# Altium schematic sheet STM32WB09.SchDoc: STM32WB09 VFQFPN32 (SMPS)
size A3; Date: Not used; ApprovedBy: Not used; CheckedBy: Not used; Author: Not used; CompanyName: STMicroelectronics; DrawnBy: Not used; Engineer: Not used; Organization: Not used; Address1: Not used; Address2: Not used; Address3: Not used; Address4: Not used; DocumentNumber: Not used; Revision: 1.0.0; SheetNumber: 2; SheetTotal: 6; CurrentTime: Not used; CurrentDate: Not used; Time: Not used; DocumentFullPathAndName: Not used; DocumentName: Not used; ModifiedDate: Not used; ImagePath: Not used; ProjectName: Not used; Application_BuildNumber: Not used
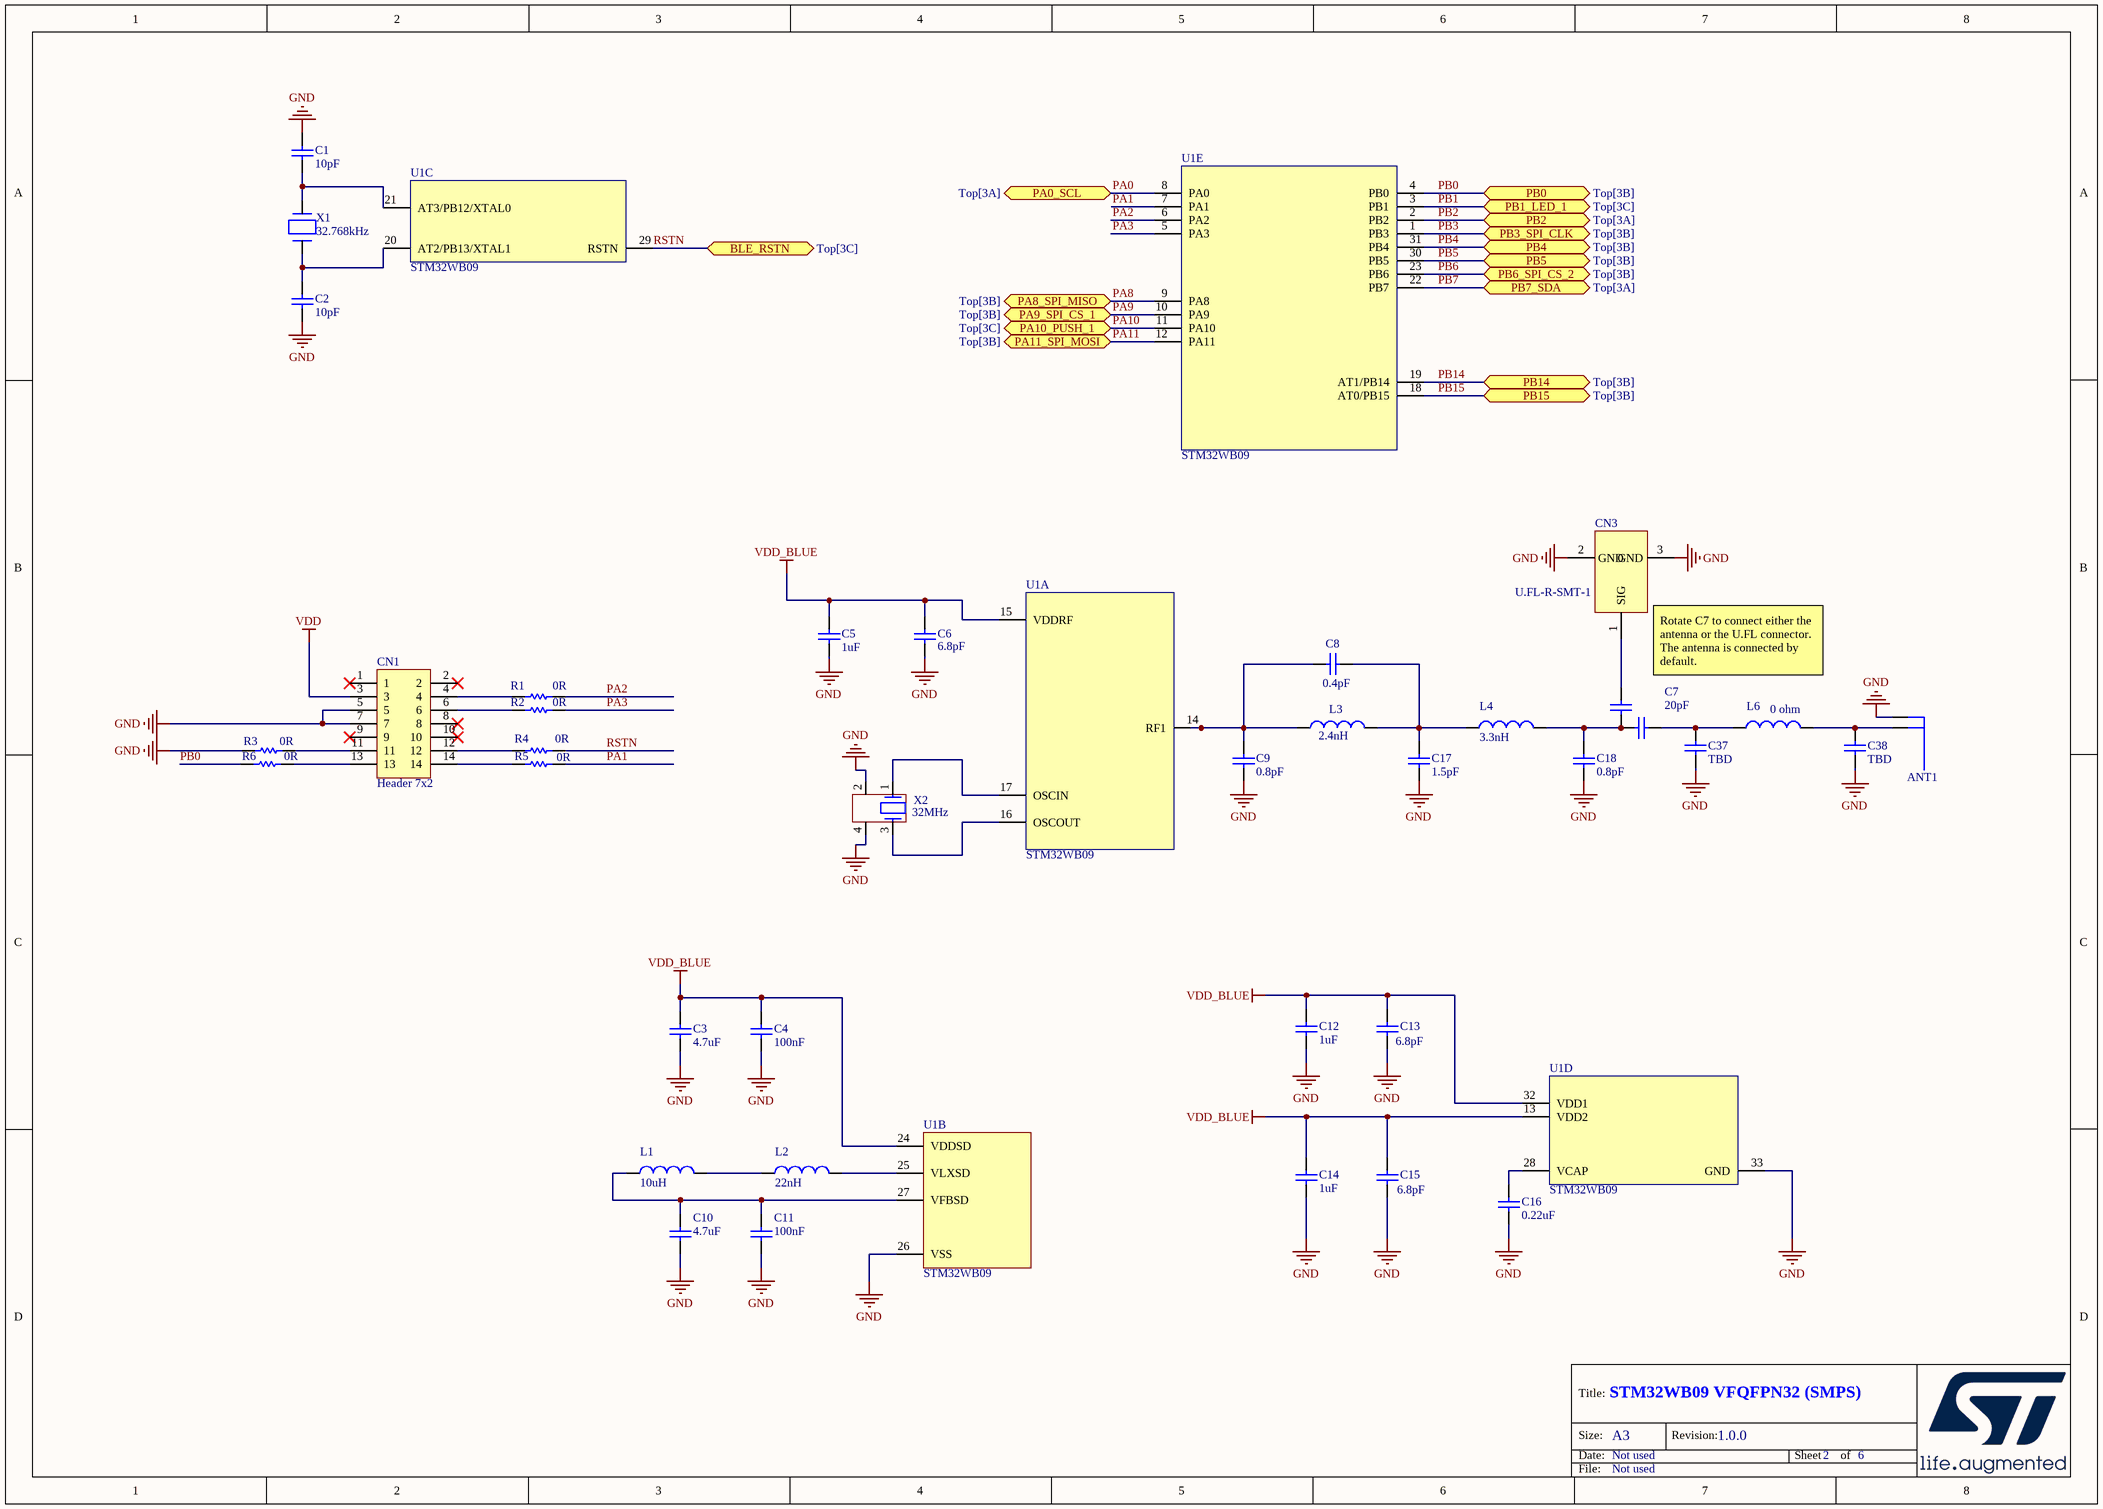
[diagram p0: STM32WB09.SchDoc]

## Parts
ANT1  BLE_ANT  [ANTENNA_F]  (value not drawn)
C1  value 10pF  [C0402]  (hidden comment: Capacitor)
C2  value 10pF  [C0402]  (hidden comment: Capacitor)
C3  value 4.7uF  [C0402]  (hidden comment: Capacitor)
C4  value 100nF  [C0201_H0P3]  (hidden comment: Capacitor)
C5  value 1uF  [C0402]  (hidden comment: Capacitor)
C6  value 6.8pF  [C0201_H0P3]  (hidden comment: Capacitor)
C7  value 20pF  [SMD 0201 DEV]  (hidden comment: 20 pF)
C8  value 0.4pF  [0_5p_capacitor_SMD_0201]  (hidden comment: Capacitor)
C9  value 0.8pF  [0_8p_capacitor_SMD_0201]  (hidden comment: Capacitor)
C10  value 4.7uF  [C0402]  (hidden comment: Capacitor)
C11  value 100nF  [C0402]  (hidden comment: Capacitor)
C12  value 1uF  [C0402]  (hidden comment: Capacitor)
C13  value 6.8pF  [C0201_H0P3]  (hidden comment: Capacitor)
C14  value 1uF  [C0402]  (hidden comment: Capacitor)
C15  value 6.8pF  [C0201_H0P3]  (hidden comment: Capacitor)
C16  value 0.22uF  [C0402]  (hidden comment: Capacitor)
C17  value 1.5pF  [1_5p_capacitor_SMD_0201]  (hidden comment: Capacitor)
C18  value 0.8pF  [0_8p_capacitor_SMD_0201]  (hidden comment: Capacitor)
C37  value TBD  [1_5p_capacitor_SMD_0201]  (hidden comment: Capacitor)
C38  value TBD  [0_8p_capacitor_SMD_0201]  (hidden comment: Capacitor)
CN1  Header 7x2  [CON_STDC14_Receiver_SMALL]
CN3  U.FL-R-SMT-1  [CON_HRS_U.FL-R-SMT-1]
L1  value 10uH  [IND_0805_MURATA_LQM21]  (hidden comment: Inductor)
L2  value 22nH  [C0402]  (hidden comment: Inductor)
L3  value 2.4nH  [2n4_inductor_SMD_0201]  (hidden comment: Inductor)
L4  value 3.3nH  [3n3_inductor_SMD_0201]  (hidden comment: Inductor)
L6  value 0 ohm  [3n3_inductor_SMD_0201]  (hidden comment: Inductor)
R1  value 0R  [R0402]  (hidden comment: Resistor)
R2  value 0R  [R0402]  (hidden comment: Resistor)
R3  value 0R  [R0402]  (hidden comment: Resistor)
R4  value 0R  [R0402]  (hidden comment: Resistor)
R5  value 0R  [R0402]  (hidden comment: Resistor)
R6  value 0R  [R0402]  (hidden comment: Resistor)
U1  STM32WB09  [ICC_QFN32-EPAD_5X5_P050]  (parts A,B,C,D,E of 5)
X1  value 32.768kHz  [CRY_NX2012SA_2P]  (hidden comment: XTAL_2_PINS)
X2  value 32MHz  [CRY_NX2016SA_4P]  (hidden comment: XTAL_4_PINS)

## Ports
BLE_RSTN (bidir, see Top[3C]), PA0_SCL (bidir, see Top[3A]), PA8_SPI_MISO (bidir, see Top[3B]), PA9_SPI_CS_1 (bidir, see Top[3B]), PA10_PUSH_1 (bidir, see Top[3C]), PA11_SPI_MOSI (bidir, see Top[3B]), PB0 (bidir, see Top[3B]), PB1_LED_1 (bidir, see Top[3C]), PB2 (bidir, see Top[3A]), PB3_SPI_CLK (bidir, see Top[3B]), PB4 (bidir, see Top[3B]), PB5 (bidir, see Top[3B]), PB6_SPI_CS_2 (bidir, see Top[3B]), PB7_SDA (bidir, see Top[3A]), PB14 (bidir, see Top[3B]), PB15 (bidir, see Top[3B])

## Nets
GND: ANT1.2 C1.2 C2.1 C3.1 C4.1 C5.1 C6.1 C9.1 C10.1 C11.1 C12.1 C13.1 C14.1 C15.1 C16.1 C17.1 C18.1 C37.1 C38.1 CN1.5 CN1.7 CN3.2(GND) CN3.3(GND) R3.1 U1.26(VSS) U1.33(GND) X2.2 X2.4
VDD: CN1.3
VDD_BLUE: C3.2 C4.2 C5.2 C6.2 C12.2 C13.2 C14.2 C15.2 U1.13(VDD2) U1.15(VDDRF) U1.24(VDDSD) U1.32(VDD1)
PA0: U1.8(PA0) ; port PA0_SCL
PA1: R5.2 U1.7(PA1)
PA2: R1.2 U1.6(PA2)
PA3: R2.2 U1.5(PA3)
PA8: U1.9(PA8) ; port PA8_SPI_MISO
PA9: U1.10(PA9) ; port PA9_SPI_CS_1
PA10: U1.11(PA10) ; port PA10_PUSH_1
PA11: U1.12(PA11) ; port PA11_SPI_MOSI
PB0: R6.1 U1.4(PB0) ; port PB0
PB1: U1.3(PB1) ; port PB1_LED_1
PB2: U1.2(PB2) ; port PB2
PB3: U1.1(PB3) ; port PB3_SPI_CLK
PB4: U1.31(PB4) ; port PB4
PB5: U1.30(PB5) ; port PB5
PB6: U1.23(PB6) ; port PB6_SPI_CS_2
PB7: U1.22(PB7) ; port PB7_SDA
PB14: U1.19(AT1/PB14) ; port PB14
PB15: U1.18(AT0/PB15) ; port PB15
RSTN: R4.2 U1.29(RSTN) ; port BLE_RSTN
NetANT1_1: ANT1.1 C38.2 L6.2
NetC1_1: C1.1 U1.21(AT3/PB12/XTAL0) X1.1(X1)
NetC2_2: C2.2 U1.20(AT2/PB13/XTAL1) X1.2(X2)
NetC7_1: C7.1 C18.2 L4.2
NetC7_2: C7.2 CN3.1(SIG)
NetC7_3: C7.3 C37.2 L6.1
NetC8_1: C8.1 C9.2 L3.1 U1.14(RF1)
NetC8_2: C8.2 C17.2 L3.2 L4.1
NetC10_2: C10.2 C11.2 L1.1 U1.27(VFBSD)
NetC16_2: C16.2 U1.28(VCAP)
NetCN1_4: CN1.4 R1.1
NetCN1_6: CN1.6 R2.1
NetCN1_11: CN1.11 R3.2
NetCN1_12: CN1.12 R4.1
NetCN1_13: CN1.13 R6.2
NetCN1_14: CN1.14 R5.1
NetL1_2: L1.2 L2.1
NetL2_2: L2.2 U1.25(VLXSD)
NetU1_16: U1.16(OSCOUT) X2.3
NetU1_17: U1.17(OSCIN) X2.1

Not connected (* = marked no-connect by the designer): CN1 1* 2* 8* 9* 10*

## Notes on the sheet
- (near CN3) Rotate C7 to connect either the antenna or the U.FL connector.
  The antenna is connected by default.
- Title:
- Size:
- Date:
- A3
- Revision:
- Sheet
- of
- File:

## Library data of the parts
ANT1 = BLE_ANT: 2.4 GHz PIFA
C1 C2 = MCD-00015: Capacitor, MLCC, 10pF, 50V, NPO, +/-5%, 0402, T=0.5mm; Part_Preference: Recommended; Manufacturer: YAGEO; Manufacturer_Part_Number: CC0402JRNPO9BN100; Order_Code_RS: 3019160RL; Component_Country_Of_Origin: China; ShowFields: YES; ID: 2465; Internal_Part_Number: MCD-00015; Status: Released; Part_Type: Capacitor; Package: 0402; ComponentLink1URL: http://tunmcdsvn.tun.st.com/Component_Documentation_Library/Trunk/Capacitor/YAGEO_NP0_Series; Order_Code_Digikey: 311-1014-1-ND; Order_Code_Farnell: 3019160RL; Manufacturer Part Number: CC0402JRNPO9BN100; Supplier: Digikey
C3 C10 = MCD-03431: Capacitor, MLCC, 4.7uF, X5R, 10V, +/-20%, 0402, T=0.5mm; Part_Preference: Recommended; Manufacturer: MURATA; Manufacturer_Part_Number: GRM155R61A475MEAAD; Order_Code_RS: 172-6870; ShowFields: YES; ID: 5547; Component_Country_Of_Origin: China, Japan, Philippines, Singapore; Internal_Part_Number: MCD-03431; Status: Checked; Part_Type: Capacitor; Package: 0402; ComponentLink1URL: http://tunmcdsvn.tun.st.com/Component_Documentation_Library/Trunk/Capacitor/MURATA_GRM_Series/GRM155R61A475MEAAD; Order_Code_Digikey: 90-14306-2-ND; Order_Code_Farnell: 2688503RL; Manufacturer Part Number: GRM155R61A475MEAAD; Supplier 1: Future Electronics; Supplier Part Number 1: 5108569
C4 = MCD-01535: Capacitor, MLCC,100nF, 10V, X5R, +/-10%, 0201, T=0.3mm; Part_Preference: Recommended; Manufacturer: MURATA; Manufacturer_Part_Number: GRM033R61A104KE15; Order_Code_RS: 790-2742; Component_Country_Of_Origin: Japan; ShowFields: YES; ID: 3635; Internal_Part_Number: MCD-01535; Status: Released; Part_Type: Capacitor; Package: 0201; ComponentLink1URL: http://tunmcdsvn.tun.st.com/Component_Documentation_Library/Trunk/Capacitor/MURATA_GRM_Series; Order_Code_Digikey: 490-5881-1-ND; Order_Code_Farnell: 2470450; Manufacturer Part Number: GRM033R61A104KE15
C5 C12 C14 = MCD-03432: Capacitor, MLCC, 1uF, X7R, 6.3V,+/- 10%, 0402, T=0.5mm; Part_Preference: Recommended; Manufacturer: MURATA; Manufacturer_Part_Number: GRM155R70J105KA12; Order_Code_RS: 113-8711; ShowFields: YES; ID: 5548; Component_Country_Of_Origin: China, Japan, Philippines, Singapore; Internal_Part_Number: MCD-03432; Status: Checked; Part_Type: Capacitor; Package: 0402; ComponentLink1URL: http://tunmcdsvn.tun.st.com/Component_Documentation_Library/Trunk/Capacitor/MURATA_GRM_Series/GRM155R70J105KA12; Order_Code_Digikey: NA; Order_Code_Farnell: NA; Manufacturer Part Number: GRM155R70J105KA12
C6 C13 C15 = MCD-02284: Cap Ceramic 6.8pF 25V C0G 0.25pF SMD 0201 125°C Paper T/R; Manufacturer: Murata; Manufacturer Part Number: GJM0335C1E6R8CB01D; ComponentLink1URL: http://tunmcdsvn.tun.st.com/Component_Documentation_Library/Trunk/Capacitor/MURATA_GRM_Series; Supplier 1: Digi-Key; Supplier Part Number 1: 490-3076-1-ND; RoHS: Yes; Category: Ceramic Capacitors; Stock 1: 9238; Pricing 1: 1=0.1, 10=0.033, 50=0.0188, 100=0.0146, 500=0.01096, 1000=0.00861, 2500=0.00783, 5000=0.0072 (USD); ComponentLink2URL: https://datasheet.ciiva.com/11611/product-11611316.pdf?src-supplier=Avnet; ComponentLink2Description: https://datasheet.ciiva.com/11611/product-11611316.pdf?src-supplier=Avnet; ComponentLink3URL: https://datasheet.ciiva.com/133/partnumbering-e-01-133417.pdf?src-supplier=Digi-Key; ComponentLink3Description: https://datasheet.ciiva.com/133/partnumbering-e-01-133417.pdf?src-supplier=Digi-Key; ComponentLink4URL: https://datasheet.ciiva.com/133/partnumbering-e-01-133418.pdf?src-supplier=Digi-Key; ComponentLink4Description: https://datasheet.ciiva.com/133/partnumbering-e-01-133418.pdf?src-supplier=Digi-Key; ComponentLink5URL: https://datasheet.ciiva.com/133/partnumbering-e-01-133419.pdf?src-supplier=Digi-Key; ComponentLink5Description: https://datasheet.ciiva.com/133/partnumbering-e-01-133419.pdf?src-supplier=Digi-Key; ComponentLink6URL: https://datasheet.ciiva.com/11611/product-11611254.pdf?src-supplier=Avnet; ComponentLink6Description: https://datasheet.ciiva.com/11611/product-11611254.pdf?src-supplier=Avnet
C7 = C_0201_DEV: Cap Ceramic 20pF 25V C0G 2% Pad SMD 0201 125C T/R; Manufacturer: Murata; Manufacturer Part Number: GJM0335C1E200GB01D; ComponentLink6URL: https://datasheet.ciiva.com/28386/pyu-rc0402-51-rohs-l-6-28386633.pdf?src-supplier=Avnet+Europe; ComponentLink6Description: https://datasheet.ciiva.com/28386/pyu-rc0402-51-rohs-l-6-28386633.pdf?src-supplier=Avnet+Europe; ComponentLink9URL: https://datasheet.ciiva.com/15189/getdatasheetpartid-326379-15189533.pdf?src-supplier=Verical; ComponentLink9Description: https://datasheet.ciiva.com/15189/getdatasheetpartid-326379-15189533.pdf?src-supplier=Verical; ComponentLink10URL: https://datasheet.ciiva.com/7983/1018594-7983535.pdf?src-supplier=Element14; ComponentLink10Description: https://datasheet.ciiva.com/7983/1018594-7983535.pdf?src-supplier=Element14; ComponentLink11URL: https://datasheet.ciiva.com/2560/pyu-r-int-thick-7-2560866.pdf?src-supplier=Digi-Key; ComponentLink11Description: https://datasheet.ciiva.com/2560/pyu-r-int-thick-7-2560866.pdf?src-supplier=Digi-Key; ComponentLink12URL: https://datasheet.ciiva.com/2560/pyu-r-int-thick-7-2560867.pdf?src-supplier=Digi-Key; ComponentLink12Description: https://datasheet.ciiva.com/2560/pyu-r-int-thick-7-2560867.pdf?src-supplier=Digi-Key; ComponentLink13URL: https://datasheet.ciiva.com/2560/pyu-r-int-thick-7-2560865.pdf?src-supplier=Digi-Key; ComponentLink13Description: https://datasheet.ciiva.com/2560/pyu-r-int-thick-7-2560865.pdf?src-supplier=Digi-Key; ComponentLink14URL: https://datasheet.ciiva.com/8887/pyu-rc0201-51-rohs-l-8-8887865.pdf?src-supplier=Avnet; ComponentLink14Description: https://datasheet.ciiva.com/8887/pyu-rc0201-51-rohs-l-8-8887865.pdf?src-supplier=Avnet; ComponentLink1URL: http://www.mouser.com/ds/2/281/c02e-2905.pdf?src-supplier=Mouser; ComponentLink1Description: http://www.mouser.com/ds/2/281/c02e-2905.pdf?src-supplier=Mouser; Supplier 1: Digi-Key; Supplier Part Number 1: 490-GJM0335C1E200GB01DCT-ND; RoHS: Yes; Category: Ceramic Capacitors; Stock 1: 21920; Pricing 1: 1=0.1, 10=0.063, 50=0.0378, 100=0.0297, 500=0.02192, 1000=0.01815, 2500=0.0169, 5000=0.01546 (USD)
C8 = MCD-02284_2: 0201 0.4 pF 25 V ±0.05 pF Tolerance C0G SMT Multilayer Ceramic Capacitor; Manufacturer: Murata; Manufacturer Part Number: GJM0335C1ER40WB01D; ComponentLink1URL: http://tunmcdsvn.tun.st.com/Component_Documentation_Library/Trunk/Capacitor/MURATA_GRM_Series; ComponentLink2URL: https://datasheet.ciiva.com/11617/product-11617172.pdf?src-supplier=Avnet; ComponentLink2Description: https://datasheet.ciiva.com/11617/product-11617172.pdf?src-supplier=Avnet; ComponentLink3URL: https://datasheet.ciiva.com/29541/partnumbering-e-01-29541903.pdf?src-supplier=Digi-Key; ComponentLink3Description: https://datasheet.ciiva.com/29541/partnumbering-e-01-29541903.pdf?src-supplier=Digi-Key; ComponentLink4URL: https://datasheet.ciiva.com/29541/partnumbering-e-01-29541902.pdf?src-supplier=Digi-Key; ComponentLink4Description: https://datasheet.ciiva.com/29541/partnumbering-e-01-29541902.pdf?src-supplier=Digi-Key; Supplier 1: Digi-Key; Supplier Part Number 1: 490-8073-1-ND; RoHS: Yes; Category: Ceramic Capacitors; Stock 1: 344905; Pricing 1: 1=0.14, 10=0.094, 50=0.0562, 100=0.0442, 500=0.03266, 1000=0.02703, 2500=0.02516, 5000=0.02302 (USD); ComponentLink5URL: https://datasheet.ciiva.com/11617/product-11617570.pdf?src-supplier=Avnet; ComponentLink5Description: https://datasheet.ciiva.com/11617/product-11617570.pdf?src-supplier=Avnet; ComponentLink6URL: https://datasheet.ciiva.com/170/gjm0335c1er30wb01-170840.pdf?src-supplier=Digi-Key; ComponentLink6Description: https://datasheet.ciiva.com/170/gjm0335c1er30wb01-170840.pdf?src-supplier=Digi-Key; ComponentLink7URL: https://datasheet.ciiva.com/29541/partnumbering-e-01-29541493.pdf?src-supplier=Digi-Key; ComponentLink7Description: https://datasheet.ciiva.com/29541/partnumbering-e-01-29541493.pdf?src-supplier=Digi-Key; ComponentLink8URL: https://datasheet.ciiva.com/29541/partnumbering-e-01-29541494.pdf?src-supplier=Digi-Key; ComponentLink8Description: https://datasheet.ciiva.com/29541/partnumbering-e-01-29541494.pdf?src-supplier=Digi-Key; ComponentLink9URL: https://datasheet.ciiva.com/29541/partnumbering-e-01-29541495.pdf?src-supplier=Digi-Key; ComponentLink9Description: https://datasheet.ciiva.com/29541/partnumbering-e-01-29541495.pdf?src-supplier=Digi-Key; ComponentLink10URL: https://datasheet.ciiva.com/16467/product-16467435.pdf?src-supplier=Future+Electronics; ComponentLink10Description: https://datasheet.ciiva.com/16467/product-16467435.pdf?src-supplier=Future+Electronics
C9 C18 C38 = MCD-02284_1: Multilayer Ceramic Capacitor, 0.8 pF, 25 V, ± 0.05pF, C0G (NP0), 0201 [0603 Metric]; Manufacturer: Murata; Manufacturer Part Number: GJM0335C1ER80WB01D; Material: 4241ConductorMaterial; Temperature Coefficient: 30ppm/°C; ComponentLink1URL: http://tunmcdsvn.tun.st.com/Component_Documentation_Library/Trunk/Capacitor/MURATA_GRM_Series; ComponentLink2URL: https://datasheet.ciiva.com/11616/product-11616837.pdf?src-supplier=Avnet; ComponentLink2Description: https://datasheet.ciiva.com/11616/product-11616837.pdf?src-supplier=Avnet; ComponentLink3URL: https://datasheet.ciiva.com/170/partnumbering-e-01-170845.pdf?src-supplier=Digi-Key; ComponentLink3Description: https://datasheet.ciiva.com/170/partnumbering-e-01-170845.pdf?src-supplier=Digi-Key; Supplier 1: Arrow Electronics; Supplier Part Number 1: GJM0335C1ER80WB01D; RoHS: Yes; Category: Ceramic Capacitors; Stock 1: 23495; Pricing 1: 1=0.072, 10=0.0302, 25=0.0296, 100=0.0178, 250=0.0176, 500=0.0175, 1000=0.0173, 3000=0.0172, 6000=0.0171, 15000=0.0169 (USD)
C11 = MCD-03442: Capacitor, MLCC, 100nF, +/-10%, X7R, 25V, 0402, T=0.5mm; Part_Preference: Recommended; Manufacturer: MURATA; Manufacturer_Part_Number: GRM155R71E104KE14D; Order_Code_RS: NA; ShowFields: YES; ID: 5558; Component_Country_Of_Origin: China, Japan, Philippines, Singapore; Internal_Part_Number: MCD-03442; Status: Checked; Part_Type: Capacitor; Package: 0402; ComponentLink1URL: http://tunmcdsvn.tun.st.com/Component_Documentation_Library/Trunk/Capacitor/MURATA_GRM_Series/GRM155R71E104KE14; Order_Code_Digikey: 490-10698-2-ND; Order_Code_Farnell: NA; Manufacturer Part Number: GRM155R71E104KE14D
C16 = MCD-03483: Capacitor, MLCC, 0.22uF, X5R, 6.3V, +/-10%, 0402, T=0.5mm; Part_Preference: Recommended; Manufacturer: YAGEO; Manufacturer_Part_Number: CC0402KRX5R5BB224; Order_Code_RS: 3369131; ShowFields: YES; ID: 5599; Component_Country_Of_Origin: China; Internal_Part_Number: MCD-03483; Status: Checked; Part_Type: Capacitor; Package: 0402; ComponentLink1URL: http://tunmcdsvn.tun.st.com/Component_Documentation_Library/Trunk/Capacitor/YAGEO_X5R_Series; Order_Code_Digikey: 311-1681-2-ND; Order_Code_Farnell: 3369131; Manufacturer Part Number: CC0402KRX5R5BB224
C17 C37 = MCD-02284_3: Multilayer Ceramic Capacitor, 1.5 pF, 25 V, ± 0.1pF, C0G (NP0), 0201 [0603 Metric]; Manufacturer: Murata; Manufacturer Part Number: GJM0335C1E1R5BB01D; Voltage Rating: 25V; ComponentLink1URL: http://tunmcdsvn.tun.st.com/Component_Documentation_Library/Trunk/Capacitor/MURATA_GRM_Series; ComponentLink2URL: https://datasheet.ciiva.com/11616/product-11616837.pdf?src-supplier=Avnet; ComponentLink2Description: https://datasheet.ciiva.com/11616/product-11616837.pdf?src-supplier=Avnet; ComponentLink3URL: https://datasheet.ciiva.com/170/partnumbering-e-01-170845.pdf?src-supplier=Digi-Key; ComponentLink3Description: https://datasheet.ciiva.com/170/partnumbering-e-01-170845.pdf?src-supplier=Digi-Key; Supplier 1: Digi-Key; Supplier Part Number 1: 490-11175-1-ND; RoHS: Yes; Category: Ceramic Capacitors; Stock 1: 1582621; Pricing 1: 1=0.1, 10=0.069, 50=0.0376, 100=0.0308, 500=0.02198, 1000=0.01727, 2500=0.0157, 5000=0.01444 (USD); Mounting Technology: Surface Mount; Case/Package: 0201; Case Code (Imperial): 0201; Case Code (Metric): 0603; Min Operating Temperature: -55°C; Max Operating Temperature: 125°C; Packaging: Tape and Reel; Package Quantity: 15000; Termination: SMD/SMT; Voltage Rating (DC): 25V; Dielectric: C0G; Series: GJM; Construction: Flat; Length: 0.6mm; Width: 0.012inch; Height: 0.3mm; Thickness: 0.013inch; Depth: 0.3mm; Radiation Hardening: No; RoHS Compliant: Yes; Lead Free: Lead Free; ComponentLink4URL: https://datasheet.ciiva.com/11615/product-11615773.pdf?src-supplier=Avnet; ComponentLink4Description: https://datasheet.ciiva.com/11615/product-11615773.pdf?src-supplier=Avnet; ComponentLink5URL: https://datasheet.ciiva.com/18183/getdatasheetpartid-480423-18183785.pdf?src-supplier=Verical; ComponentLink5Description: https://datasheet.ciiva.com/18183/getdatasheetpartid-480423-18183785.pdf?src-supplier=Verical
CN1 = MCD-00639: Header, 7x2, 1.27mm, VR, SMD, T=5.97mm; Part_Type: Connector; Part_Preference: Recommended; Manufacturer: SAMTEC; Manufacturer_Part_Number: FTSH-107-01-L-DV-K; Order_Code_RS: 179-8765; Component_Country_Of_Origin: China, Costa Rica, Malaysia, United States, Vietnam; ShowFields: YES; ID: 3107; Internal_Part_Number: MCD-00639; Value: Header 7x2; Status: Released; ComponentLink1URL: http://tunmcdsvn.tun.st.com/Component_Documentation_Library/Trunk/Connector/SAMTEC_FTSH_Series/; Order_Code_Digikey: SAM9449-ND; Order_Code_Farnell: 2856443; Manufacturer Part Number: FTSH-107-01-L-DV-K
CN3 = MCD-01583: Connector_RF, 0Hz to 6GHz, 50R, VR, SMD, T= 1.25mm; BMS_Part_Number: 9187005; Part_Preference: Recommended; Manufacturer: HIROSE; Order_Code_RS: 557-981; Component_Country_Of_Origin: Japan, Malaysia; ShowFields: YES; ID: 3683; Value: Con_RF_U.FL-R-SMT-1; Internal_Part_Number: MCD-01583; Status: Released; Part_Type: Connector; Manufacturer_Part_Number: U.FL-R-SMT-1; ComponentLink1URL: http://tunmcdsvn.tun.st.com/Component_Documentation_Library/Trunk/Connector/HIROSE_U.FL_Series/; Order_Code_Digikey: N/A; Order_Code_Farnell: 1688077; Manufacturer Part Number: U.FL-R-SMT-1
L1 = MCD-03438: Inductor, MLCC, 10uH, +/-20%, 300mA, 845mR, 0805, T=1.45mm; Part_Preference: Recommended; Manufacturer: MURATA; Manufacturer_Part_Number: LQM21DN100M70L; Order_Code_RS: NA; ShowFields: YES; ID: 5554; Component_Country_Of_Origin: Japan; Internal_Part_Number: MCD-03438; Status: Checked; Part_Type: Inductor; Package: 0805; ComponentLink1URL: http://tunmcdsvn.tun.st.com/Component_Documentation_Library/Trunk/Inductor/MURATA_LQM21DN100M70L; Order_Code_Digikey: 490-LQM21DN100M70LTR-ND; Order_Code_Farnell: NA; Manufacturer Part Number: LQM21DN100M70L
L2 = MCD-03439: Inductor, MLCC, 22nH, +/-2%, 350mA, 0.58R, 0402, T=1.45mm; Part_Preference: Recommended; Manufacturer: MURATA; Manufacturer_Part_Number: LQG15HN22NG02D; Order_Code_RS: 3354168; ShowFields: YES; ID: 5555; Component_Country_Of_Origin: Japan; Internal_Part_Number: MCD-03439; Status: Checked; Part_Type: Inductor; Package: 0402; ComponentLink1URL: http://tunmcdsvn.tun.st.com/Component_Documentation_Library/Trunk/Inductor/MURATA_LQG15HN22NG02D; Order_Code_Digikey: 490-LQG15HN22NG02DTR-ND; Order_Code_Farnell: 3354168; Manufacturer Part Number: LQG15HN22NG02D
L3 = MCD-03552: Inductor RF Chip Thin Film 2.4nH 0.1nH 500MHz 14Q-Factor 500mA 200mOhm DCR 0201 Paper T/R; Manufacturer: Murata; Manufacturer Part Number: LQP03TN2N4B02D; ComponentLink1URL: http://tunmcdsvn.tun.st.com/Component_Documentation_Library/Trunk/Inductor/MURATA_LQP03TG_Series/LQP03TG0N5B02D; ComponentLink2URL: https://datasheet.ciiva.com/29692/s0084e-29692446.pdf?src-supplier=Digi-Key; ComponentLink2Description: https://datasheet.ciiva.com/29692/s0084e-29692446.pdf?src-supplier=Digi-Key; Supplier 1: Digi-Key; Supplier Part Number 1: 490-6724-1-ND; RoHS: Yes; Category: Fixed Inductors; Stock 1: 40543; Pricing 1: 1=0.1, 10=0.041, 25=0.0364, 50=0.031, 100=0.0273, 250=0.025, 500=0.02272, 1000=0.01909, 2500=0.01636 (USD); ComponentLink3URL: https://datasheet.ciiva.com/16444/product-16444478.pdf?src-supplier=Future+Electronics; ComponentLink3Description: https://datasheet.ciiva.com/16444/product-16444478.pdf?src-supplier=Future+Electronics; ComponentLink4URL: https://datasheet.ciiva.com/14826/1750lqp03tn2n4b0223-14826711.pdf?src-supplier=Arrow+Electronics; ComponentLink4Description: https://datasheet.ciiva.com/14826/1750lqp03tn2n4b0223-14826711.pdf?src-supplier=Arrow+Electronics
L4 = MCD-03552_1: Inductor RF Chip Thin Film 3.3nH 0.1nH 500MHz 14Q-Factor 450mA 250mOhm DCR 0201 Paper T/R; Manufacturer: Murata; Manufacturer Part Number: LQP03TN3N3B02D; ComponentLink1URL: http://tunmcdsvn.tun.st.com/Component_Documentation_Library/Trunk/Inductor/MURATA_LQP03TG_Series/LQP03TG0N5B02D; ComponentLink2URL: https://datasheet.ciiva.com/29692/s0084e-29692446.pdf?src-supplier=Digi-Key; ComponentLink2Description: https://datasheet.ciiva.com/29692/s0084e-29692446.pdf?src-supplier=Digi-Key; ComponentLink3URL: https://datasheet.ciiva.com/16444/product-16444478.pdf?src-supplier=Future+Electronics; ComponentLink3Description: https://datasheet.ciiva.com/16444/product-16444478.pdf?src-supplier=Future+Electronics; ComponentLink4URL: https://datasheet.ciiva.com/14826/1750lqp03tn2n4b0223-14826711.pdf?src-supplier=Arrow+Electronics; ComponentLink4Description: https://datasheet.ciiva.com/14826/1750lqp03tn2n4b0223-14826711.pdf?src-supplier=Arrow+Electronics; Supplier 1: Digi-Key; Supplier Part Number 1: 490-6728-1-ND; RoHS: Yes; Category: Fixed Inductors; Stock 1: 987695; Pricing 1: 1=0.1, 10=0.041, 25=0.0364, 50=0.031, 100=0.0273, 250=0.025, 500=0.02272, 1000=0.01909, 2500=0.01636 (USD); ComponentLink5URL: https://datasheet.ciiva.com/4976/product-4976199.pdf?src-supplier=Mouser; ComponentLink5Description: https://datasheet.ciiva.com/4976/product-4976199.pdf?src-supplier=Mouser
L6 = MCD-03552_1: 0201 0 ohm; ComponentLink1URL: http://tunmcdsvn.tun.st.com/Component_Documentation_Library/Trunk/Inductor/MURATA_LQP03TG_Series/LQP03TG0N5B02D; ComponentLink2URL: https://datasheet.ciiva.com/29692/s0084e-29692446.pdf?src-supplier=Digi-Key; ComponentLink2Description: https://datasheet.ciiva.com/29692/s0084e-29692446.pdf?src-supplier=Digi-Key; ComponentLink3URL: https://datasheet.ciiva.com/16444/product-16444478.pdf?src-supplier=Future+Electronics; ComponentLink3Description: https://datasheet.ciiva.com/16444/product-16444478.pdf?src-supplier=Future+Electronics; ComponentLink4URL: https://datasheet.ciiva.com/14826/1750lqp03tn2n4b0223-14826711.pdf?src-supplier=Arrow+Electronics; ComponentLink4Description: https://datasheet.ciiva.com/14826/1750lqp03tn2n4b0223-14826711.pdf?src-supplier=Arrow+Electronics; ComponentLink5URL: https://datasheet.ciiva.com/4976/product-4976199.pdf?src-supplier=Mouser; ComponentLink5Description: https://datasheet.ciiva.com/4976/product-4976199.pdf?src-supplier=Mouser
R1-R6 = MCD-00052: Resistor, 0R, 0402, +/-5%, 1/16W; Part_Preference: Recommended; Manufacturer: YAGEO; Manufacturer_Part_Number: RC0402JR-070RL; Order_Code_RS: 9232516RL; Component_Country_Of_Origin: China; ShowFields: YES; ID: 2540; Internal_Part_Number: MCD-00052; Status: Released; Part_Type: Resistor; Package: 0402; ComponentLink1URL: http://tunmcdsvn.tun.st.com/Component_Documentation_Library/Trunk/Resistor/YAGEO_RC_L_Series; Order_Code_Digikey: 311-0.0JRCT-ND; Order_Code_Farnell: 9232516RL; Manufacturer Part Number: RC0402JR-070RL
U1 = MCD-03444: Bluetooth® Low Energy wireless SoC; Part_Type: IC; Part_Preference: Recommended; Manufacturer: STMICROELECTRONICS; Component_Country_Of_Origin: Unknown; ShowFields: YES; ID: 5560; Internal_Part_Number: MCD-03444; Value: STM32WB09; Status: Checked; Manufacturer_Part_Number: STM32WB09; Package: QFN32; ComponentLink1URL: http://tunmcdsvn.tun.st.com/Component_Documentation_Library/Trunk/IC/STMICROELECTRONICS_BLUENRG-372AC; Order_Code_Digikey: N/A; Order_Code_Farnell: N/A; Order_Code_RS: N/A; Manufacturer Part Number: STM32WB09
X1 = MCD-01445: Crystal, 32.768kHz, 7pF, +/-20ppm, 80K, 2.05x1.2mm; BMS_Part_Number: 9157043; Part_Type: Crystal_Osc; Part_Preference: Recommended; Manufacturer: NDK; Manufacturer_Part_Number: NX2012SA-32.768KHZ-EXS00A-MU00389; Component_Country_Of_Origin: Unknown; ShowFields: YES; ID: 3545; Internal_Part_Number: MCD-01445; Status: Checked; Package: 2.05x1.2mm; ComponentLink1URL: http://tunmcdsvn.tun.st.com/Component_Documentation_Library/Trunk/Crytal_Oscillator/NDK_NX2012SA_Series; Order_Code_Digikey: 644-1350; Order_Code_Farnell: N/A; Order_Code_RS: N/A; Manufacturer Part Number: NX2012SA-32.768KHZ-EXS00A-MU00389
X2 = MCD-01446: Crystal, 32MHz, 8pF, +/-10ppm, 60R, 2x1.6mm; BMS_Part_Number: 9157042; Part_Type: Crystal_Osc; Part_Preference: Recommended; Manufacturer: NDK; Manufacturer_Part_Number: NX2016SA-32MHZ-EXS00A-CS06654; Component_Country_Of_Origin: Unknown; ShowFields: YES; ID: 3546; Internal_Part_Number: MCD-01446; Status: Checked; Package: 2x1.6mm; ComponentLink1URL: http://tunmcdsvn.tun.st.com/Component_Documentation_Library/Trunk/Crytal_Oscillator/NDK_NX2016SA_Series; Order_Code_Digikey: 644-1373; Order_Code_Farnell: N/A; Order_Code_RS: N/A; Manufacturer Part Number: NX2016SA-32MHZ-EXS00A-CS06654